# Altium schematic sheet MCU.SchDoc
size 292 x 193 mm; Author: Power Lin; DocumentNumber: 3; SheetNumber: 3; SheetTotal: 3; Website: wiki-power.com
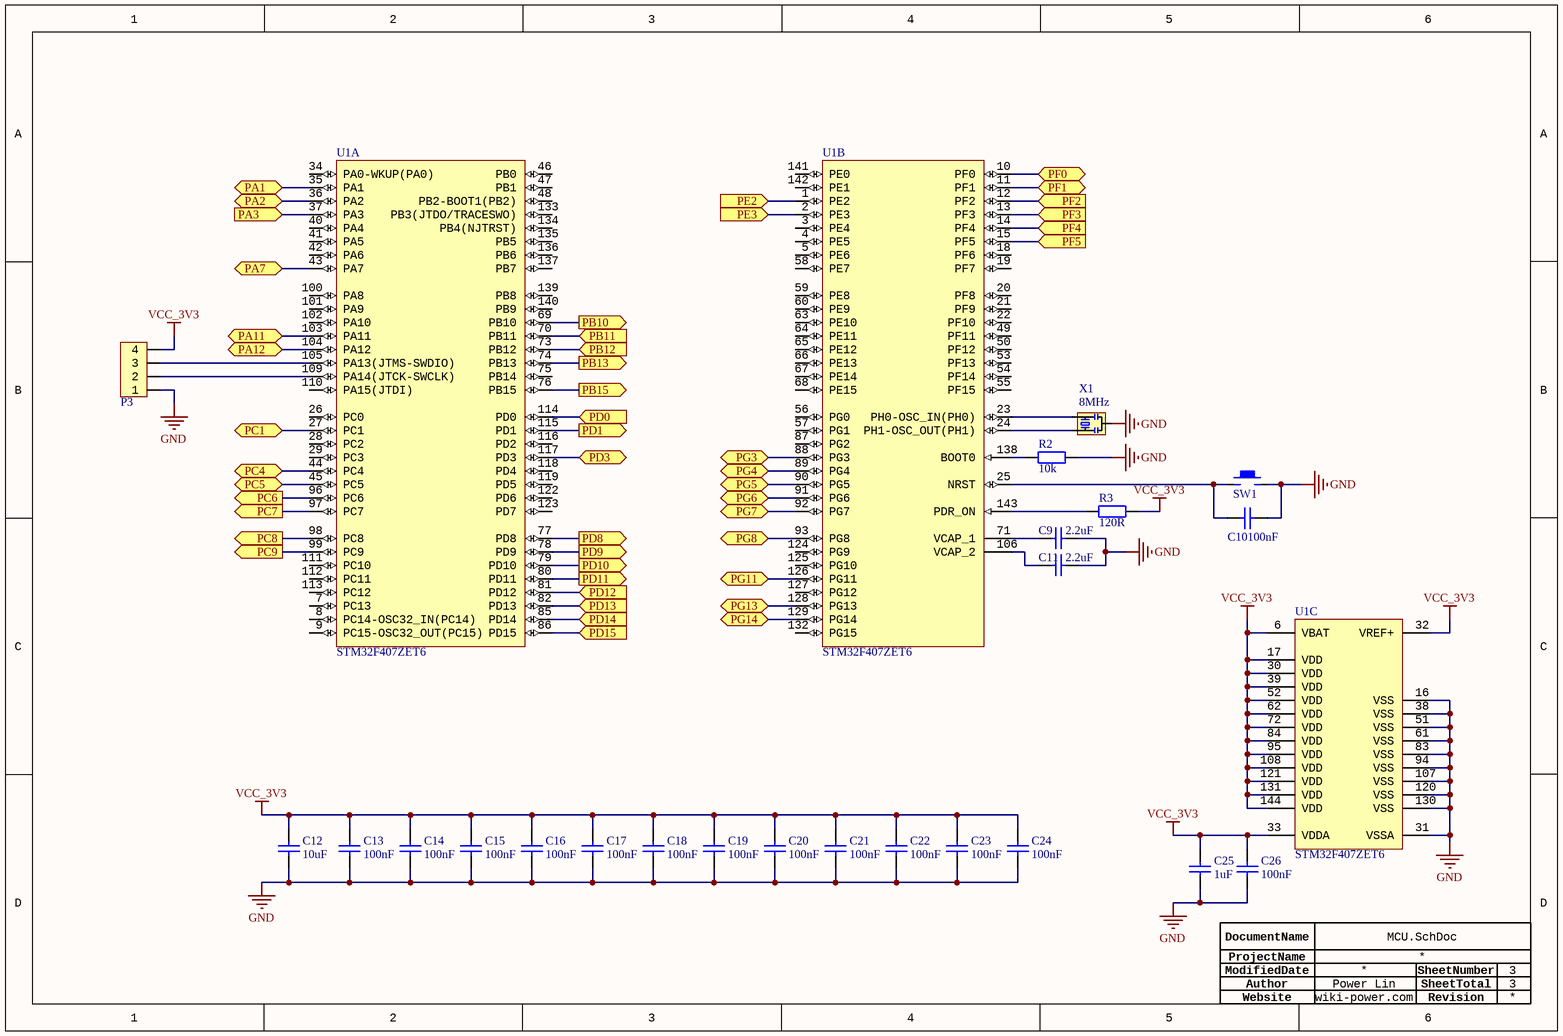
[diagram p0: MCU.SchDoc]

## Parts
C9  2.2uF  [CAP-0603]
C10  100nF  [CAP-0603]
C11  2.2uF  [CAP-0603]
C12  10uF  [CAP-0603]
C13  100nF  [CAP-0603]
C14  100nF  [CAP-0603]
C15  100nF  [CAP-0603]
C16  100nF  [CAP-0603]
C17  100nF  [CAP-0603]
C18  100nF  [CAP-0603]
C19  100nF  [CAP-0603]
C20  100nF  [CAP-0603]
C21  100nF  [CAP-0603]
C22  100nF  [CAP-0603]
C23  100nF  [CAP-0603]
C24  100nF  [CAP-0603]
C25  1uF  [CAP-0603]
C26  100nF  [CAP-0603]
P3  HDR1x4_2.54  [HDR1x4_2.54_180]  (value not drawn)
R2  10k  [R-0603]
R3  120R  [R-0603]
SW1  KEY  [KEY-4P-4.2*3.4*2.5]  (value not drawn)
U1  STM32F407ZET6  [STM-LQFP144_N]  (parts A,B,C of 3)
X1  8MHz  [SMD3213-3P]

## Ports
PA1 (bidir), PA2 (bidir), PA3 (in), PA7 (bidir), PA11 (bidir), PA12 (bidir), PB10 (out), PB11 (in), PB12 (in), PB13 (out), PB15 (out), PC1 (bidir), PC4 (bidir), PC5 (bidir), PC6 (out), PC7 (out), PC8 (out), PC9 (out), PD0 (in), PD1 (out), PD3 (bidir), PD8 (out), PD9 (out), PD10 (out), PD11 (out), PD12 (in), PD13 (in), PD14 (in), PD15 (in), PE2 (in), PE3 (in), PF0 (bidir), PF1 (bidir), PF2 (in), PF3 (in), PF4 (in), PF5 (in), PG3 (bidir), PG4 (bidir), PG5 (bidir), PG6 (bidir), PG7 (bidir), PG8 (bidir), PG11 (bidir), PG13 (bidir), PG14 (bidir)

## Nets
GND: C9.2 C10.1 C11.2 C12.1 C13.1 C14.1 C15.1 C16.1 C17.1 C18.1 C19.1 C20.1 C21.1 C22.1 C23.1 C24.1 C25.1 C26.1 P3.1 R2.1 SW1.2 U1.16(VSS) U1.31(VSSA) U1.38(VSS) U1.51(VSS) U1.61(VSS) U1.83(VSS) U1.94(VSS) U1.107(VSS) U1.120(VSS) U1.130(VSS) X1.2(GND)
VCC_3V3: C12.2 C13.2 C14.2 C15.2 C16.2 C17.2 C18.2 C19.2 C20.2 C21.2 C22.2 C23.2 C24.2 C25.2 C26.2 P3.4 R3.1 U1.6(VBAT) U1.17(VDD) U1.30(VDD) U1.32(VREF+) U1.33(VDDA) U1.39(VDD) U1.52(VDD) U1.62(VDD) U1.72(VDD) U1.84(VDD) U1.95(VDD) U1.108(VDD) U1.121(VDD) U1.131(VDD) U1.144(VDD)
PA1: U1.35(PA1) ; port PA1
PA2: U1.36(PA2) ; port PA2
PA3: U1.37(PA3) ; port PA3
PA7: U1.43(PA7) ; port PA7
PA11: U1.103(PA11) ; port PA11
PA12: U1.104(PA12) ; port PA12
PB10: U1.69(PB10) ; port PB10
PB11: U1.70(PB11) ; port PB11
PB12: U1.73(PB12) ; port PB12
PB13: U1.74(PB13) ; port PB13
PB15: U1.76(PB15) ; port PB15
PC1: U1.27(PC1) ; port PC1
PC4: U1.44(PC4) ; port PC4
PC5: U1.45(PC5) ; port PC5
PC6: U1.96(PC6) ; port PC6
PC7: U1.97(PC7) ; port PC7
PC8: U1.98(PC8) ; port PC8
PC9: U1.99(PC9) ; port PC9
PD0: U1.114(PD0) ; port PD0
PD1: U1.115(PD1) ; port PD1
PD3: U1.117(PD3) ; port PD3
PD8: U1.77(PD8) ; port PD8
PD9: U1.78(PD9) ; port PD9
PD10: U1.79(PD10) ; port PD10
PD11: U1.80(PD11) ; port PD11
PD12: U1.81(PD12) ; port PD12
PD13: U1.82(PD13) ; port PD13
PD14: U1.85(PD14) ; port PD14
PD15: U1.86(PD15) ; port PD15
PE2: U1.1(PE2) ; port PE2
PE3: U1.2(PE3) ; port PE3
PF0: U1.10(PF0) ; port PF0
PF1: U1.11(PF1) ; port PF1
PF2: U1.12(PF2) ; port PF2
PF3: U1.13(PF3) ; port PF3
PF4: U1.14(PF4) ; port PF4
PF5: U1.15(PF5) ; port PF5
PG3: U1.88(PG3) ; port PG3
PG4: U1.89(PG4) ; port PG4
PG5: U1.90(PG5) ; port PG5
PG6: U1.91(PG6) ; port PG6
PG7: U1.92(PG7) ; port PG7
PG8: U1.93(PG8) ; port PG8
PG11: U1.126(PG11) ; port PG11
PG13: U1.128(PG13) ; port PG13
PG14: U1.129(PG14) ; port PG14
NetC9_1: C9.1 U1.71(VCAP_1)
NetC10_2: C10.2 SW1.1 U1.25(NRST)
NetC11_1: C11.1 U1.106(VCAP_2)
NetP3_2: P3.2 U1.109(PA14(JTCK-SWCLK))
NetP3_3: P3.3 U1.105(PA13(JTMS-SWDIO))
NetR2_2: R2.2 U1.138(BOOT0)
NetR3_2: R3.2 U1.143(PDR_ON)
NetU1_23: U1.23(PH0-OSC_IN(PH0)) X1.3(OSC2)
NetU1_24: U1.24(PH1-OSC_OUT(PH1)) X1.1(OSC1)

Not connected (* = marked no-connect by the designer): U1 3(PE4) 4(PE5) 5(PE6) 7(PC13) 8(PC14-OSC32_IN(PC14)) 9(PC15-OSC32_OUT(PC15)) 18(PF6) 19(PF7) 20(PF8) 21(PF9) 22(PF10) 26(PC0) 28(PC2) 29(PC3) 34(PA0-WKUP(PA0)) 40(PA4) 41(PA5) 42(PA6) 46(PB0) 47(PB1) 48(PB2-BOOT1(PB2)) 49(PF11) 50(PF12) 53(PF13) 54(PF14) 55(PF15) 56(PG0) 57(PG1) 58(PE7) 59(PE8) 60(PE9) 63(PE10) 64(PE11) 65(PE12) 66(PE13) 67(PE14) 68(PE15) 75(PB14) 87(PG2) 100(PA8) 101(PA9) 102(PA10) 110(PA15(JTDI)) 111(PC10) 112(PC11) 113(PC12) 116(PD2) 118(PD4) 119(PD5) 122(PD6) 123(PD7) 124(PG9) 125(PG10) 127(PG12) 132(PG15) 133(PB3(JTDO/TRACESWO)) 134(PB4(NJTRST)) 135(PB5) 136(PB6) 137(PB7) 139(PB8) 140(PB9) 141(PE0) 142(PE1)

## Notes on the sheet
- Author
- DocumentName
- ModifiedDate
- ProjectName
- SheetNumber
- SheetTotal
- Website
- Revision

## Library data of the parts
C9-C26 = CAP: 贴片电容; ComponentLink1Description: 供应商链接; ComponentLink1URL: http://www.szlcsc.com/product/details_53938.html; Package: 0402; Supplier: LC; SuppliersPartNumber: C52923
P3 = HDR1x4_2.54: Header
R2 R3 = RES: 贴片电阻; Package: 0805; Supplier: LC; SuppliersPartNumber: C17798
SW1 = KEY: 按键开关
U1 = STM32F407ZET6: ARM Cortex-M4 32-bit MCU+FPU, 210 DMIPS, 512 kB Flash, 192 kB Internal RAM, 114 I/Os, 144-pin LQFP, -40 to 85 degC, Tray; Manufacturer: STMicroelectronics; D/A Converter: 2x12-bit; FLASH Size (Prog) (kB): 512; I/Os (High Current): 114; Internal RAM Size (kB): 192; Operating Frequency(F) (Processor speed) (MHz): 168; Supply Voltage(Vcc) max (V): 3.6; Supply Voltage(Vcc) min (V): 1.8; DatasheetVersion: Rev. 4; PackageVersion: Rev. 4, 06/2013; PackageReference: LQFP144; PackageDescription: 144-Pin Low Profile Quad Flat Package, 20 x 20 mm Body, 0.5 mm Pitch; Supplier 1: Digi-Key; Supplier Part Number 1: 497-11903-ND; Supplier 2: Farnell; Supplier Part Number 2: 2215229; Supplier 3: Newark; Supplier Part Number 3: 46W2203; Supplier 4: Newark; Supplier Part Number 4: 87T3795; Supplier 5: Mouser; Supplier Part Number 5: 511-STM32F407ZET6; Core: ARM Cortex-M4; Packing: Tray; Mounting Technology: Surface Mount; PartNumber: STM32F407ZET6; ComponentLink1Description: Manufacturer URL; ComponentLink1URL: http://www.st.com/web/en/home.html; ComponentLink2Description: Datasheet; ComponentLink2URL: http://www.st.com/st-web-ui/static/active/en/resource/technical/document/datasheet/DM00037051.pdf; ComponentLink3Description: Package Specification; ComponentLink3URL: http://www.st.com/st-web-ui/static/active/en/resource/technical/document/datasheet/DM00037051.pdf
X1 = XTAL: CSTCE8M00G15C99-R0